# EAGLE design DAB+ FM Radio (EAGLE 7.6.0)
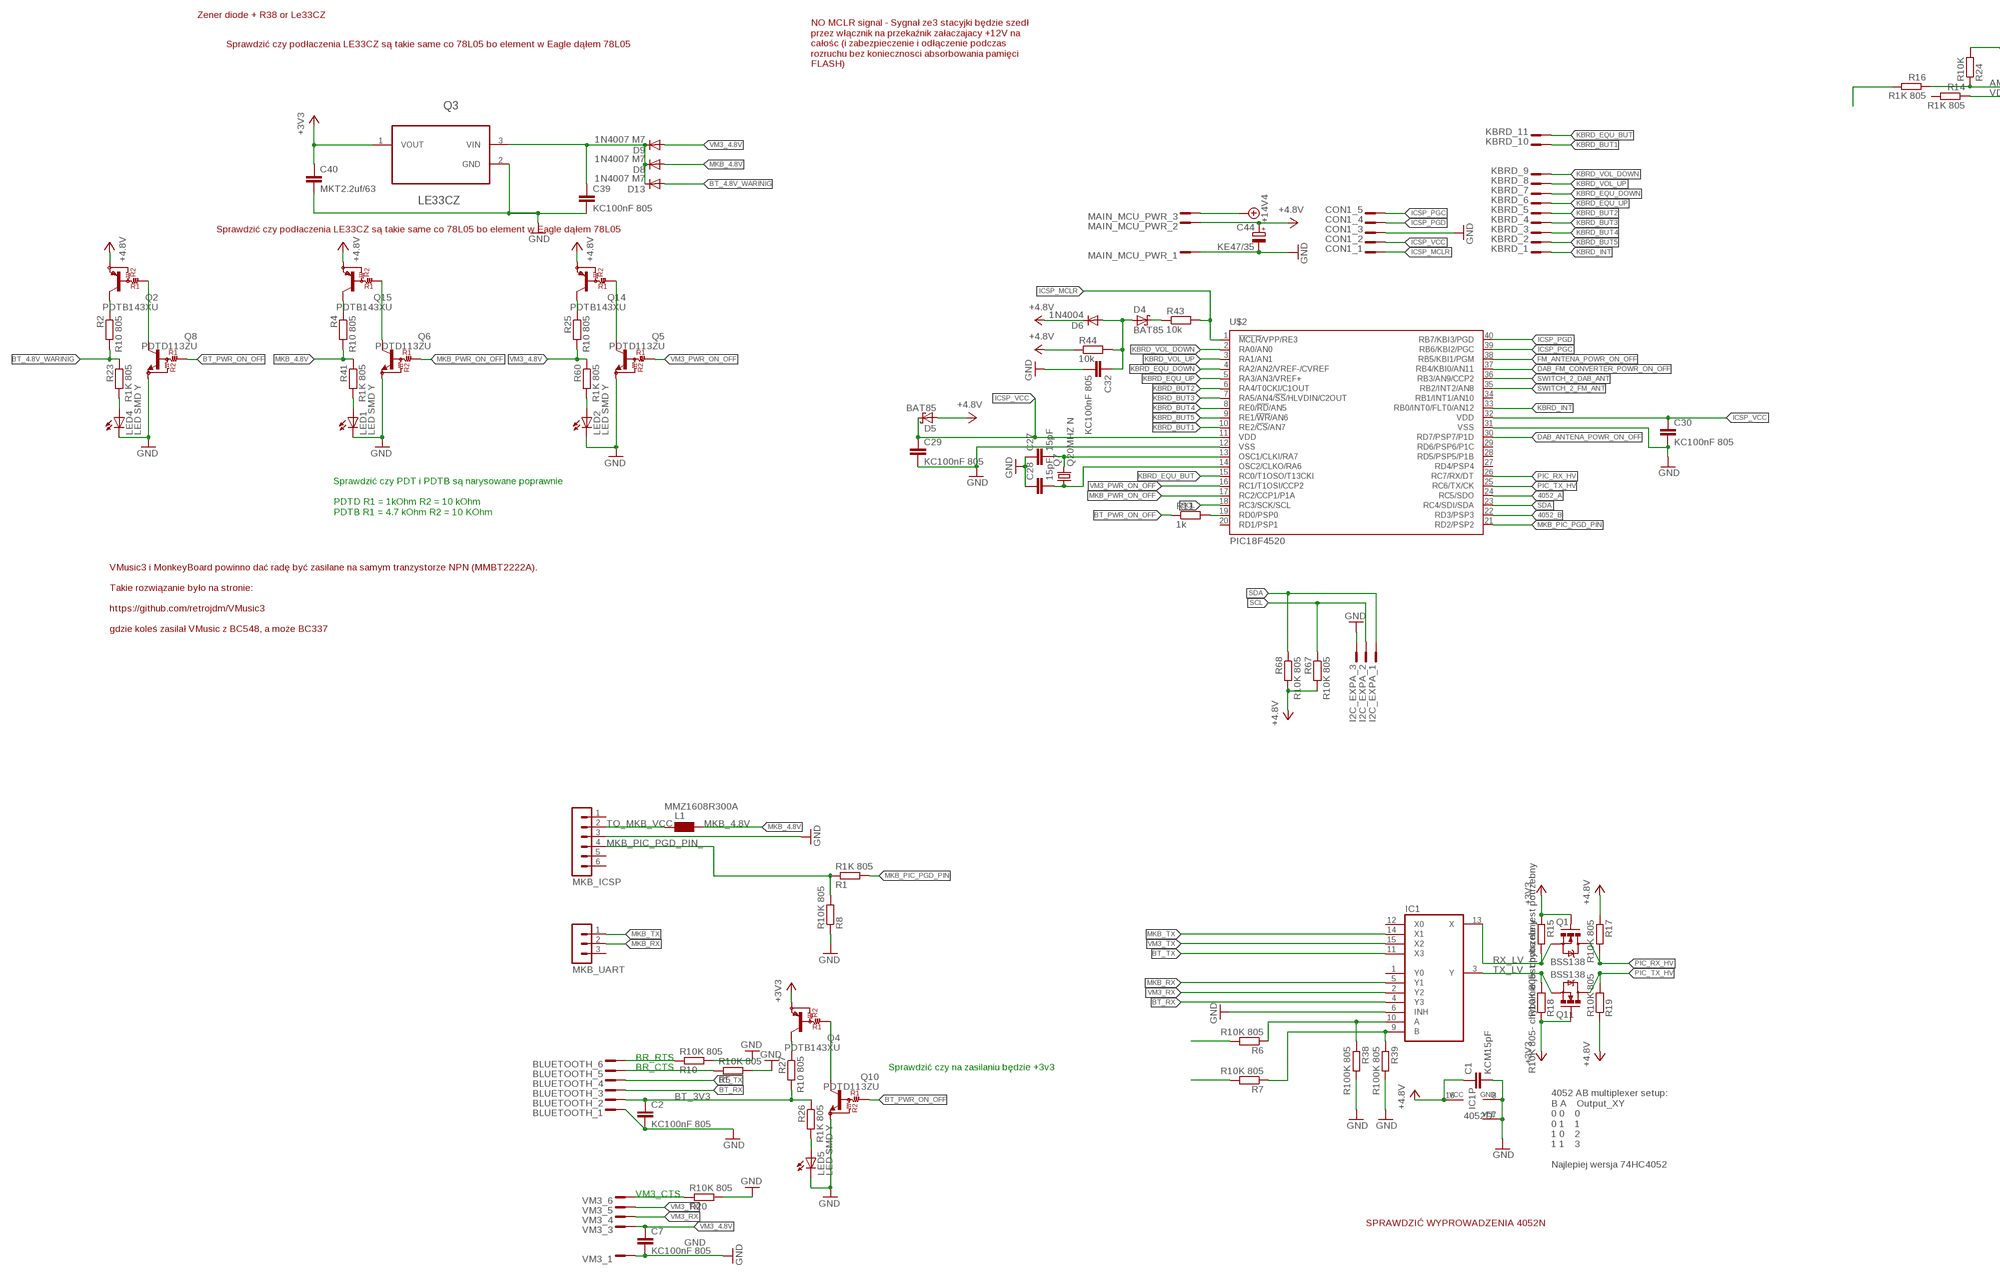
[diagram p0: schematic, sheet 1, part 1 of 2]
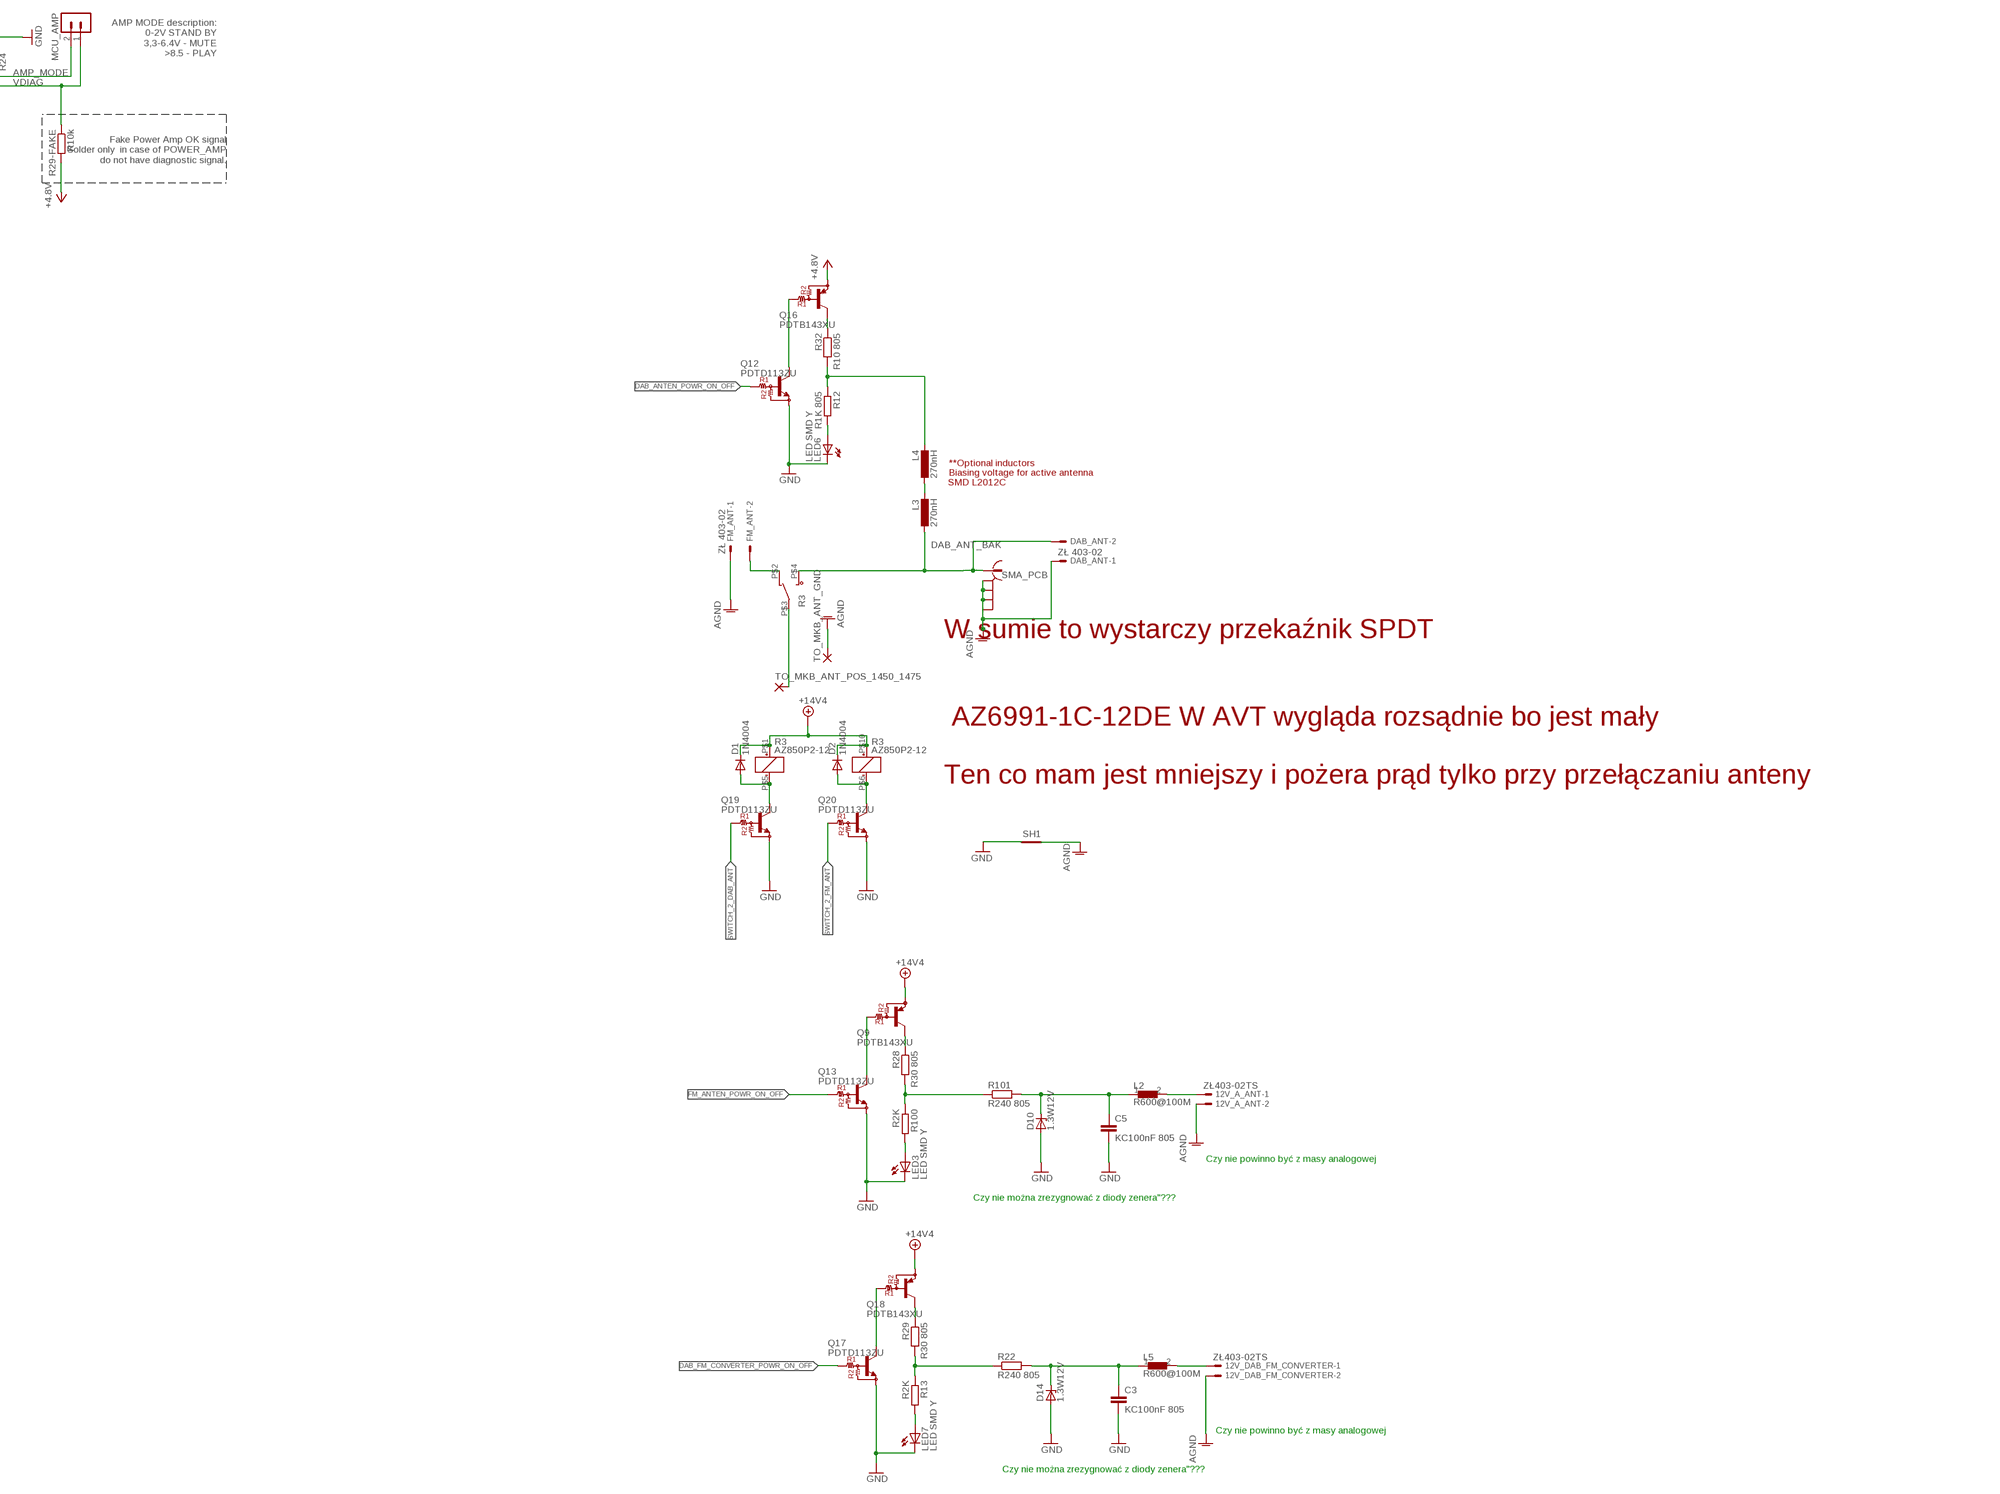
[diagram p1: schematic, sheet 1, part 2 of 2]

## Parts
12V_A_ANT  ZŁ403-02TS  22-23-2021  [22-23-2021]
12V_DAB_FM_CONVERTER  ZŁ403-02TS  22-23-2021  [22-23-2021]
BLUETOOTH  JST_6_PIN_B6B-PH-KS  [B6B-PH-KS]
C1  KCM15pF  C-EUC0805  [C0805]
C2  KC100nF 805  C-EUC0805  [C0805]
C3  KC100nF 805  C-EUC0805  [C0805]
C5  KC100nF 805  C-EUC0805  [C0805]
C7  KC100nF 805  C-EUC0805  [C0805]
C27  15pF  C-EUC0805  [C0805]
C28  15pF  C-EUC0805  [C0805]
C29  KC100nF 805  C-EUC0805  [C0805]
C30  KC100nF 805  C-EUC0805  [C0805]
C32  KC100nF 805  C-EUC0805  [C0805]
C39  KC100nF 805  C-EUC0805  [C0805]
C40  MKT2.2uf/63  C-EU025-030X050  [C025-030X050]
C44  KE47/35  CPOL-EUTT2D6  [TT2D6]
CON1  JST_5_PIN_B5B-PH-KS  [B5B-PH-KS]
D1  1N4004  1N4004DO41-7.6  [DO41-7.6]
D2  1N4004  1N4004DO41-7.6  [DO41-7.6]
D4  BAT85  BAT85DO34-V  [DO34-V]
D5  BAT85  BAT85DO34-5  [DO34-5]
D6  1N4004  1N4004DO41-V  [DO41-V]
D8  1N4007 M7  1N4004DO41-V  [DO41-V]
D9  1N4007 M7  1N4004DO41-V  [DO41-V]
D10  1.3W12V  ZENER-DIODEZD-2.5  [ZDIO-2.5]
D13  1N4007 M7  1N4004DO41-V  [DO41-V]
D14  1.3W12V  ZENER-DIODEZD-2.5  [ZDIO-2.5]
DAB_ANT  ZŁ 403-02  22-27-2021-02  [6410-02]
DAB_ANT_BAK  SMA_PCB  [SMA_PCB]
FM_ANT  ZŁ 403-02  22-27-2021-02  [6410-02]
I2C_EXPA  JST_3_PIN_B3B-PH-KS  [B3B-PH-KS]
IC1  4052D  [SO16]
KBRD  JST_11_PIN_B11B-PH-KS  [B11B-PH-KS]
L1  MMZ1608R300A  WE-CBF_0603  [0603]
L2  R600@100M  FERRITR0805  [R0805]
L3  270nH  L-EUL2012C  [L2012C]
L4  270nH  L-EUL2012C  [L2012C]
L5  R600@100M  FERRITR0805  [R0805]
LED1  LED SMD Y  LEDCHIP-LED0805  [CHIP-LED0805]
LED2  LED SMD Y  LEDCHIP-LED0805  [CHIP-LED0805]
LED3  LED SMD Y  LED  [SMARTLED-TTW]
LED4  LED SMD Y  LEDCHIP-LED0805  [CHIP-LED0805]
LED5  LED SMD Y  LEDCHIP-LED0805  [CHIP-LED0805]
LED6  LED SMD Y  LED  [SMARTLED-TTW]
LED7  LED SMD Y  LED  [SMARTLED-TTW]
MAIN_MCU_PWR  JST_3_PIN_B3B-XH-A  [B3B-XH-A]
MCU_AMP  MA02-1  [MA02-1]
MKB_ICSP  MA06-1  [MA06-1]
MKB_UART  MA03-1  [MA03-1]
Q1  BSS138  MOSFET-NCHANNELSMD  [SOT23-3]
Q2  PDTB143XU  [SOT-23]
Q3  LE33CZ  [TO127P254X749-3]
Q4  PDTB143XU  [SOT-23]
Q5  PDTD113ZU  [SOT-23]
Q6  PDTD113ZU  [SOT-23]
Q7  Q20MHZ N  CRYSTALHC49S  [HC49/S]
Q8  PDTD113ZU  [SOT-23]
Q9  PDTB143XU  [SOT-23]
Q10  PDTD113ZU  [SOT-23]
Q11  BSS138  MOSFET-NCHANNELSMD  [SOT23-3]
Q12  PDTD113ZU  [SOT-23]
Q13  PDTD113ZU  [SOT-23]
Q14  PDTB143XU  [SOT-23]
Q15  PDTB143XU  [SOT-23]
Q16  PDTB143XU  [SOT-23]
Q17  PDTD113ZU  [SOT-23]
Q18  PDTB143XU  [SOT-23]
Q19  PDTD113ZU  [SOT-23]
Q20  PDTD113ZU  [SOT-23]
R1  R1K 805  R-EU_R0805  [R0805]
R2  R10 805  R-EU_R0805  [R0805]
R3  AZ850P2-12  [AZ850-2C]
R4  R10 805  R-EU_R0805  [R0805]
R5  R10K 805  R-EU_R0805  [R0805]
R6  R10K 805  R-EU_R0805  [R0805]
R7  R10K 805  R-EU_R0805  [R0805]
R8  R10K 805  R-EU_R0805  [R0805]
R10  R10K 805  R-EU_R0805  [R0805]
R11  1k  R-EU_R0805  [R0805]
R12  R1K 805  R-EU_R0805  [R0805]
R13  R2K  R-EU_R0805  [R0805]
R14  R1K 805  R-EU_R0805  [R0805]
R15  R10K 805- chyba nie jest potrzebny  R-EU_R0805  [R0805]
R16  R1K 805  R-EU_R0805  [R0805]
R17  R10K 805  R-EU_R0805  [R0805]
R18  R10K 805- chyba nie jest potrzebny  R-EU_R0805  [R0805]
R19  R10K 805  R-EU_R0805  [R0805]
R20  R10K 805  R-EU_R0805  [R0805]
R22  R240 805  R-EU_M0805  [M0805]
R23  R1K 805  R-EU_R0805  [R0805]
R24  R10K  R-EU_R0805  [R0805]
R25  R10 805  R-EU_R0805  [R0805]
R26  R1K 805  R-EU_R0805  [R0805]
R27  R10 805  R-EU_R0805  [R0805]
R28  R30 805  R-EU_R0805  [R0805]
R29  R30 805  R-EU_R0805  [R0805]
R29-FAKE  R10k  R-EU_0204/7  [0204/7]
R32  R10 805  R-EU_R0805  [R0805]
R38  R100K 805  R-EU_M0805  [M0805]
R39  R100K 805  R-EU_M0805  [M0805]
R41  R1K 805  R-EU_R0805  [R0805]
R43  10k  R-EU_R0805  [R0805]
R44  10k  R-EU_M0805  [M0805]
R60  R1K 805  R-EU_R0805  [R0805]
R67  R10K 805  R-EU_R0805  [R0805]
R68  R10K 805  R-EU_R0805  [R0805]
R100  R2K  R-EU_R0805  [R0805]
R101  R240 805  R-EU_M0805  [M0805]
SH1  SHORT-HT5  [SHORT_TOP-50]
TO_MKB_ANT_GND  2,54/0,8  [2,54/0,8]
TO_MKB_ANT_POS_1450_1475  2,54/0,8  [2,54/0,8]
U$2  PIC18F4520  [DIL40]
VM3  JST_6_PIN_B6B-PH-KS  [B6B-PH-KS]

## Nets
4052_A: R6.2 U$2.24(RC5/SDO)
4052_B: R7.2 U$2.22(RD3/PSP3)
+3V3: C40.1 Q1.1(G) Q3.1(VOUT) Q4.2(E) Q11.1(G) R15.1 R18.1
+5V: C1.1 C44.+ D5.A D6.C IC1.16(VCC) MAIN_MCU_PWR.P$2 Q2.2(E) Q14.2(E) Q15.2(E) Q16.2(E) R17.1 R19.1 R29-FAKE.2 R44.1 R67.2 R68.2 ; supply symbol labelled +4.8V
+14V4: D1.C D2.C MAIN_MCU_PWR.P$3 Q9.2(E) Q18.2(E) R3.P$1(S$1:+) R3.P$10(R$2:+)
AGND: 12V_A_ANT.2 12V_DAB_FM_CONVERTER.2 DAB_ANT.1 DAB_ANT_BAK.GND@1(GND) DAB_ANT_BAK.GND@2(GND) DAB_ANT_BAK.GND@3(GND) DAB_ANT_BAK.GND@4(GND) FM_ANT.1 SH1.2 TO_MKB_ANT_GND.1(P)
AMP_MODE: MCU_AMP.2 R16.1 R24.1
BT_3V3: BLUETOOTH.P$2 C2.1 R26.1 R27.2
BT_4.8V_WARINIG: D13.A R2.2 R23.1
BT_PWR_ON_OFF: Q8.1(B) Q10.1(B) R11.1
BT_RX: BLUETOOTH.P$3 IC1.4(Y3)
BT_TX: BLUETOOTH.P$4 IC1.11(X3)
DAB_ANTEN_POWR_ON_OFF: Q12.1(B)
DAB_ANTENA_POWR_ON_OFF: U$2.30(RD7/PSP7/P1D)
DAB_FM_CONVERTER_POWR_ON_OFF: Q17.1(B) U$2.37(RB4/KBI0/AN11)
FM_ANTEN_POWR_ON_OFF: Q13.1(B)
FM_ANTENA_POWR_ON_OFF: U$2.38(RB5/KBI1/PGM)
GND: BLUETOOTH.P$1 C1.2 C2.2 C3.2 C5.2 C7.2 C27.1 C28.1 C29.2 C30.2 C32.2 C39.2 C40.2 C44.- CON1.P$3 D10.A D14.A I2C_EXPA.P$3 IC1.6(INH) IC1.7(VEE) IC1.8(GND) LED1.C LED2.C LED3.C@1(C) LED4.C LED5.C LED6.C@1(C) LED7.C@1(C) MAIN_MCU_PWR.P$1 MKB_ICSP.3 Q3.2(GND) Q5.2(E) Q6.2(E) Q8.2(E) Q10.2(E) Q12.2(E) Q13.2(E) Q17.2(E) Q19.2(E) Q20.2(E) R5.2 R8.1 R10.2 R20.2 R24.2 R38.2 R39.2 SH1.1 U$2.12(VSS) U$2.31(VSS) VM3.P$1
ICSP_MCLR: CON1.P$1 R43.2 U$2.1(!MCLR!/VPP/RE3)
ICSP_PGC: CON1.P$5 U$2.39(RB6/KBI2/PGC)
ICSP_PGD: CON1.P$4 U$2.40(RB7/KBI3/PGD)
ICSP_VCC: C29.1 C30.1 CON1.P$2 D5.C U$2.11(VDD) U$2.32(VDD)
KBRD_BUT1: KBRD.P$10 U$2.10(RE2/!CS!/AN7)
KBRD_BUT2: KBRD.P$5 U$2.6(RA4/T0CKI/C1OUT)
KBRD_BUT3: KBRD.P$4 U$2.7(RA5/AN4/!SS!/HLVDIN/C2OUT)
KBRD_BUT4: KBRD.P$3 U$2.8(RE0/!RD!/AN5)
KBRD_BUT5: KBRD.P$2 U$2.9(RE1/!WR!/AN6)
KBRD_EQU_BUT: KBRD.P$11 U$2.15(RC0/T1OSO/T13CKI)
KBRD_EQU_DOWN: KBRD.P$7 U$2.4(RA2/AN2/VREF-/CVREF)
KBRD_EQU_UP: KBRD.P$6 U$2.5(RA3/AN3/VREF+)
KBRD_INT: KBRD.P$1 U$2.33(RB0/INT0/FLT0/AN12)
KBRD_VOL_DOWN: KBRD.P$9 U$2.2(RA0/AN0)
KBRD_VOL_UP: KBRD.P$8 U$2.3(RA1/AN1)
MKB_4.8V: D8.A L1.2 R4.2 R41.1
MKB_PIC_PGD_PIN: R1.2 U$2.21(RD2/PSP2)
MKB_PIC_PGD_PIN_: MKB_ICSP.4 R1.1 R8.2
MKB_PWR_ON_OFF: Q6.1(B) U$2.17(RC2/CCP1/P1A)
MKB_RX: IC1.5(Y1) MKB_UART.2
MKB_TX: IC1.14(X1) MKB_UART.1
N$1: L4.1 R12.1 R32.2
N$2: D1.A Q19.3(C) R3.P$5(S$1:-)
N$3: R3.P$3 TO_MKB_ANT_POS_1450_1475.1(P)
N$4: DAB_ANT.2 DAB_ANT_BAK.P$1 L3.2 R3.P$4
N$5: FM_ANT.2 R3.P$2
N$6: D2.A Q20.3(C) R3.P$6(R$2:-)
N$7: Q2.3(C) R2.1
N$8: R16.2
N$12: L3.1 L4.2
N$13: IC1.9(B) R7.1 R39.1
N$15: C27.2 Q7.2 U$2.13(OSC1/CLKI/RA7)
N$16: C28.2 Q7.1 U$2.14(OSC2/CLKO/RA6)
N$17: R11.2 U$2.19(RD0/PSP0)
N$18: Q15.3(C) R4.1
N$19: Q2.1(B) Q8.3(C)
N$20: Q12.3(C) Q16.1(B)
N$21: LED4.A R23.2
N$22: Q4.1(B) Q10.3(C)
N$23: LED6.A@1(A) R12.2
N$24: LED5.A R26.2
N$25: Q17.3(C) Q18.1(B)
N$26: R13.1 R22.1 R29.2
N$27: LED7.A@1(A) R13.2
N$28: Q5.3(C) Q14.1(B)
N$29: C3.1 D14.C L5.1 R22.2
N$30: 12V_DAB_FM_CONVERTER.1 L5.2
N$31: LED2.A R60.2
N$32: Q14.3(C) R25.1
N$33: Q16.3(C) R32.1
N$34: Q9.3(C) R28.1
N$35: Q18.3(C) R29.1
N$36: Q4.3(C) R27.1
N$37: Q6.3(C) Q15.1(B)
N$38: BLUETOOTH.P$5 R5.1
N$39: LED1.A R41.2
N$41: D4.C R43.1
N$42: C32.1 D4.A D6.A R44.2
N$43: BLUETOOTH.P$6 R10.1
N$44: R20.1 VM3.P$6
N$47: IC1.10(A) R6.1 R38.1
N$68: C39.1 D8.C D9.C D13.C Q3.3(VIN)
N$85: Q9.1(B) Q13.3(C)
N$87: R28.2 R100.1 R101.1
N$88: LED3.A@1(A) R100.2
N$91: C5.1 D10.C L2.1 R101.2
N$92: 12V_A_ANT.1 L2.2
PIC_RX_HV: Q1.3(D) R17.2 U$2.26(RC7/RX/DT)
PIC_TX_HV: Q11.3(D) R19.2 U$2.25(RC6/TX/CK)
RX_LV: IC1.13(X) Q1.2(S) R15.2
SCL: I2C_EXPA.P$2 R67.1 U$2.18(RC3/SCK/SCL)
SDA: I2C_EXPA.P$1 R68.1 U$2.23(RC4/SDI/SDA)
SWITCH_2_DAB_ANT: Q19.1(B) U$2.36(RB3/AN9/CCP2)
SWITCH_2_FM_ANT: Q20.1(B) U$2.35(RB2/INT2/AN8)
TO_MKB_VCC: L1.1 MKB_ICSP.2
TX_LV: IC1.3(Y) Q11.2(S) R18.2
VDIAG: MCU_AMP.1 R14.1 R29-FAKE.1
VM3_4.8V: C7.1 D9.A R25.2 R60.1 VM3.P$3
VM3_PWR_ON_OFF: Q5.1(B) U$2.16(RC1/T1OSI/CCP2)
VM3_RX: IC1.2(Y2) VM3.P$4
VM3_TX: IC1.15(X2) VM3.P$5
Unconnected: IC1.1(Y0) IC1.12(X0) MKB_ICSP.1 MKB_ICSP.5 MKB_ICSP.6 MKB_UART.3 R3.P$7 R3.P$8 R3.P$9 R14.2 U$2.20(RD1/PSP1) U$2.27(RD4/PSP4) U$2.28(RD5/PSP5/P1B) U$2.29(RD6/PSP6/P1C) U$2.34(RB1/INT1/AN10) VM3.P$2

## Notes on the sheet
- Zener diode + R38 or Le33CZ
- Sprawdzić czy podłaczenia LE33CZ są takie same co 78L05 bo element w Eagle dąłem 78L05
- NO MCLR signal - Sygnał ze3 stacyjki będzie szedł
  przez włącznik na przekaźnik załaczajacy +12V na
  całośc (i zabezpieczenie i odłączenie podczas
  rozruchu bez koniecznosci absorbowania pamięci
  FLASH)
- AMP MODE description:
  0-2V STAND BY
  3,3-6.4V - MUTE
  >8.5 - PLAY
- Fake Power Amp OK signal
  Solder only  in case of POWER_AMP
  do not have diagnostic signal.
- Sprawdzić czy podłaczenia LE33CZ są takie same co 78L05 bo element w Eagle dąłem 78L05
- **Optional inductors
- Biasing voltage for active antenna
- SMD L2012C
- Sprawdzić czy PDT i PDTB są narysowane poprawnie
  
  PDTD R1 = 1kOhm R2 = 10 kOhm
  PDTB R1 = 4.7 kOhm R2 = 10 KOhm
- VMusic3 i MonkeyBoard powinno dać radę być zasilane na samym tranzystorze NPN (MMBT2222A).
  
  Takie rozwiązanie było na stronie:
  
  https://github.com/retrojdm/VMusic3
  
  gdzie koleś zasilał VMusic z BC548, a może BC337
- W sumie to wystarczy przekaźnik SPDT
  
  
   AZ6991-1C-12DE W AVT wygląda rozsądnie bo jest mały
  
  Ten co mam jest mniejszy i pożera prąd tylko przy przełączaniu anteny
- BR_RTS
- BR_CTS | Sprawdzić czy na zasilaniu będzie +3v3
- 4052 AB multiplexer setup:
  B A    Output_XY
  0 0    0
  0 1    1
  1 0    2
  1 1    3
  
  Najlepiej wersja 74HC4052
- Czy nie powinno być z masy analogowej
- VM3_CTS
- Czy nie można zrezygnować z diody zenera"???
- SPRAWDZIĆ WYPROWADZENIA 4052N
- Czy nie powinno być z masy analogowej
- Czy nie można zrezygnować z diody zenera"???

## Library data of the parts
12V_A_ANT 12V_DAB_FM_CONVERTER = con-molex:22-23-2021: .100" (2.54mm) Center Header - 2 Pin; MF: MOLEX; MPN: 22-23-2021; OC_FARNELL: 1462926; OC_NEWARK: 25C3832
BLUETOOTH VM3 = conn-JST:JST_6_PIN_
C1-C3 C5 C7 C27-C30 C32 C39 C40 = rcl:C-EU: CAPACITOR, European symbol
C44 = rcl:CPOL-EU: POLARIZED CAPACITOR, European symbol
CON1 = conn-JST:JST_5_PIN_
D1 D2 D6 D8 D9 D13 = diode_SileliS:1N4004: DIODE general purpose rectifier, 1 A
D4 D5 = diode_SileliS:BAT85
D10 D14 = diode:ZENER-DIODE: Z-Diode
DAB_ANT FM_ANT = con-molex:22-?-02: CONNECTOR wire to board 2.54 mm (.1 inch) pitch header; OC_FARNELL: unknown; OC_NEWARK: unknown
DAB_ANT_BAK = Monkey:SMA_PCB: TE CONNECTIVITY - 5-1814832-1 - SOCKET, SMA, STRAIGHT PCB,50OHM Manufacturer: TE CONNECTIVITY Order Code: 1248990 Manufacturer Part No: 5-1814832-1 http://www.farnell.com/datasheets/316178.pdf
I2C_EXPA MAIN_MCU_PWR = conn-JST:JST_3_PIN_
IC1 = 40xx:4052: Dual 4-channel ANALOG MULTIPLEXER
KBRD = conn-JST:JST_11_PIN_
L1 = wuerth-elektronik:WE-CBF: SMD EMI Suppression Ferrite Beads - excellent anti-EMI properties - low DCR - impedances till 3000 ohms - rated current up to 6 A
L2 L5 = ferrit_bear:FERRIT
L3 L4 = resistor:L-EU: INDUCTOR, European symbol
LED1-LED7 = adafruit:LED: LED OSRAM: - CHIPLED LG R971, LG N971, LY N971, LG Q971, LY Q971, LO R971, LY R971 LH N974, LH R974 LS Q976, LO Q976, LY Q976 LO Q996 - Hyper CHIPLED LW Q18S LB Q993, LB Q99A, LB R99A - SideLED LS A670, LO A670, LY A670, LG A670, LP A670 LB A673, LV A673, LT A673, LW A673 LH A674 LY A675 LS A676, LA A676, LO A676, LY A676, LW A676 LS A679, LY A679, LG A679 - Hyper Micro SIDELED® LS Y876, LA Y876, LO Y876, LY Y876 LT Y87S - SmartLED LW L88C, LW L88S LB L89C, LB L89S, LG L890 LS L89K, LO L89K, LY L89K LS L896, LA L896, LO L896, LY L896 - TOPLED LS T670, LO T670, LY T670, LG T670, LP T670 LSG T670, LSP T670, LSY T670, LOP T670, LYG T670 LG T671, LOG T671, LSG T671 LB T673, LV T673, LT T673, LW T673 LH T674 LS T676, LA T676, LO T676, LY T676, LB T676, LH T676, LSB T676, LW T676 LB T67C, LV T67C, LT T67C, LS T67K, LO T67K, LY T67K, LW E67C LS E67B, LA E67B, LO E67B, LY E67B, LB E67C, LV E67C, LT E67C LW T67C LS T679, LY T679, LG T679 LS T770, LO T770, LY T770, LG T770, LP T770 LB T773, LV T773, LT T773, LW T773 LH T774 LS E675, LA E675, LY E675, LS T675 LS T776, LA T776, LO T776, LY T776, LB T776 LHGB T686 LT T68C, LB T68C - Hyper Mini TOPLED® LB M676 - Mini TOPLED Santana® LG M470 LS M47K, LO M47K, LY M47K Source: http://www.osram.convergy.de/
MCU_AMP = con-lstb_SileliS:MA02-1: PIN HEADER
MKB_ICSP = con-lstb:MA06-1: PIN HEADER; OC_FARNELL: unknown; OC_NEWARK: unknown
MKB_UART = con-lstb:MA03-1: PIN HEADER; OC_FARNELL: unknown; OC_NEWARK: unknown
Q1 Q11 = SparkFun:MOSFET-NCHANNEL
Q2 Q4 Q9 Q14-Q16 Q18 = pre-bias-transistor:PDTB: PNP Resistor-Equipped Transistor (RET) family in a very small SOT323 (SC-70) Surface-Mounted Device (SMD) plastic package. VCC = -50 IC (max) = -500mA; R1: 4.7 kOhm; R2: 10 kOhm
Q3 = LE33cz:LE33CZ: VOLTAGE REGULATORS; MPN: LE33CZ; OC_FARNELL: 9755349; OC_NEWARK: 26M0166; PACKAGE: TO-92; SUPPLIER: STMICROELECTRONICS
Q5 Q6 Q8 Q10 Q12 Q13 Q17 Q19 Q20 = pre-bias-transistor:PDTD: Pre biase NPN transistor NPN Resistor-Equipped Transistor (RET) family in a very small SOT323 (SC-70) Surface-Mounted Device (SMD) plastic package. VCC = 50V Ic (max) = 500 mA; R1: 1 kOhm; R2: 10 kOhm
Q7 = adafruit:CRYSTAL: CRYSTAL; OC_FARNELL: 1667008; OC_NEWARK: unknown
R1 R2 R4-R8 R10-R20 R22-R29 R29-FAKE R32 R38 R39 R41 R43 R44 R60 R67 R68 R100 R101 = rcl:R-EU_: RESISTOR, European symbol
R3 = relay_silelis:AZ850P2-12
SH1 = shorts-old:SHORT-H: Short between two nets; BOM: no
TO_MKB_ANT_GND TO_MKB_ANT_POS_1450_1475 = wirepad:2,54/0,8: THROUGH-HOLE PAD
U$2 = microchip_SileliS:PIC18F4*20

## Board
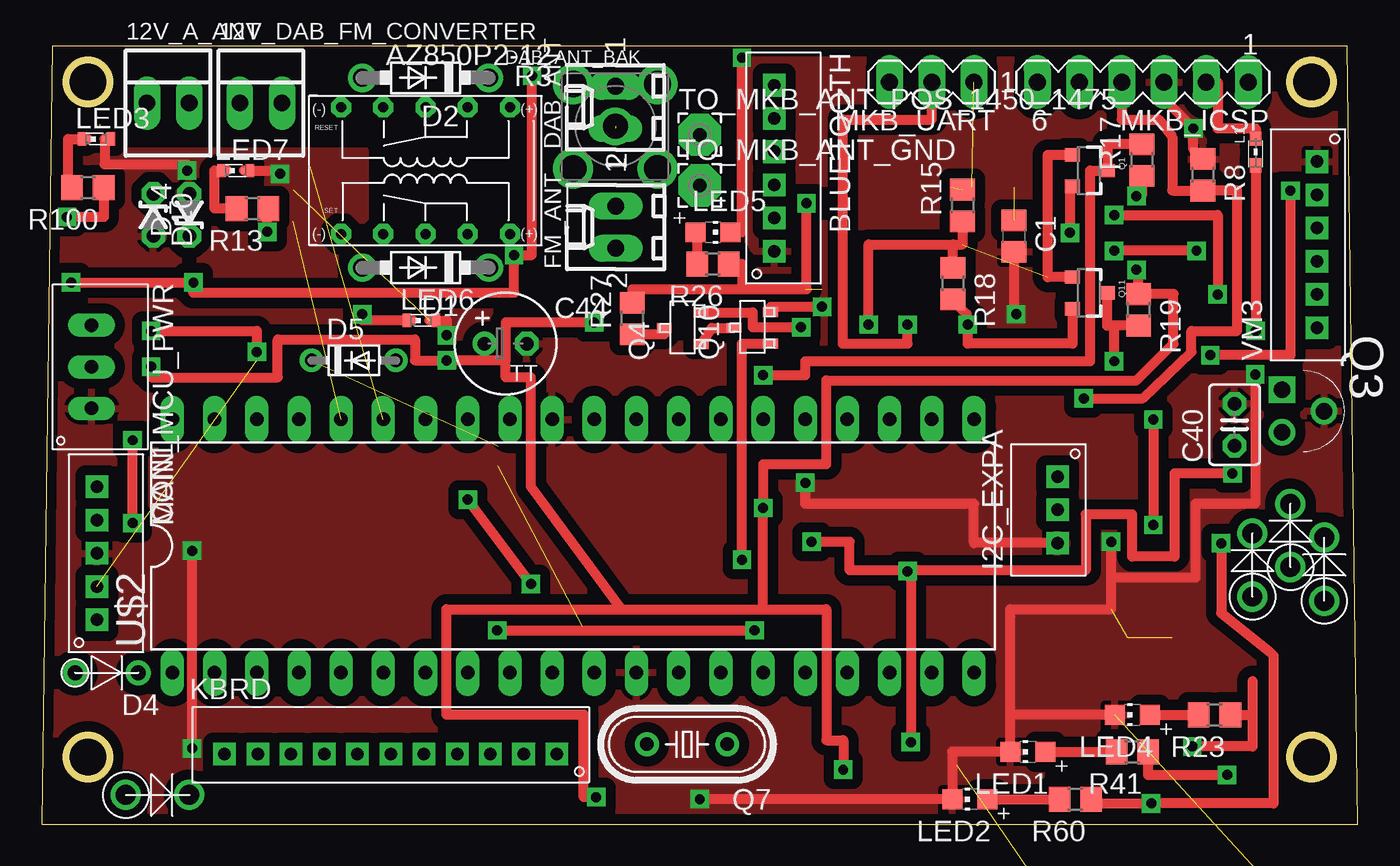
[diagram p2: board, top side]
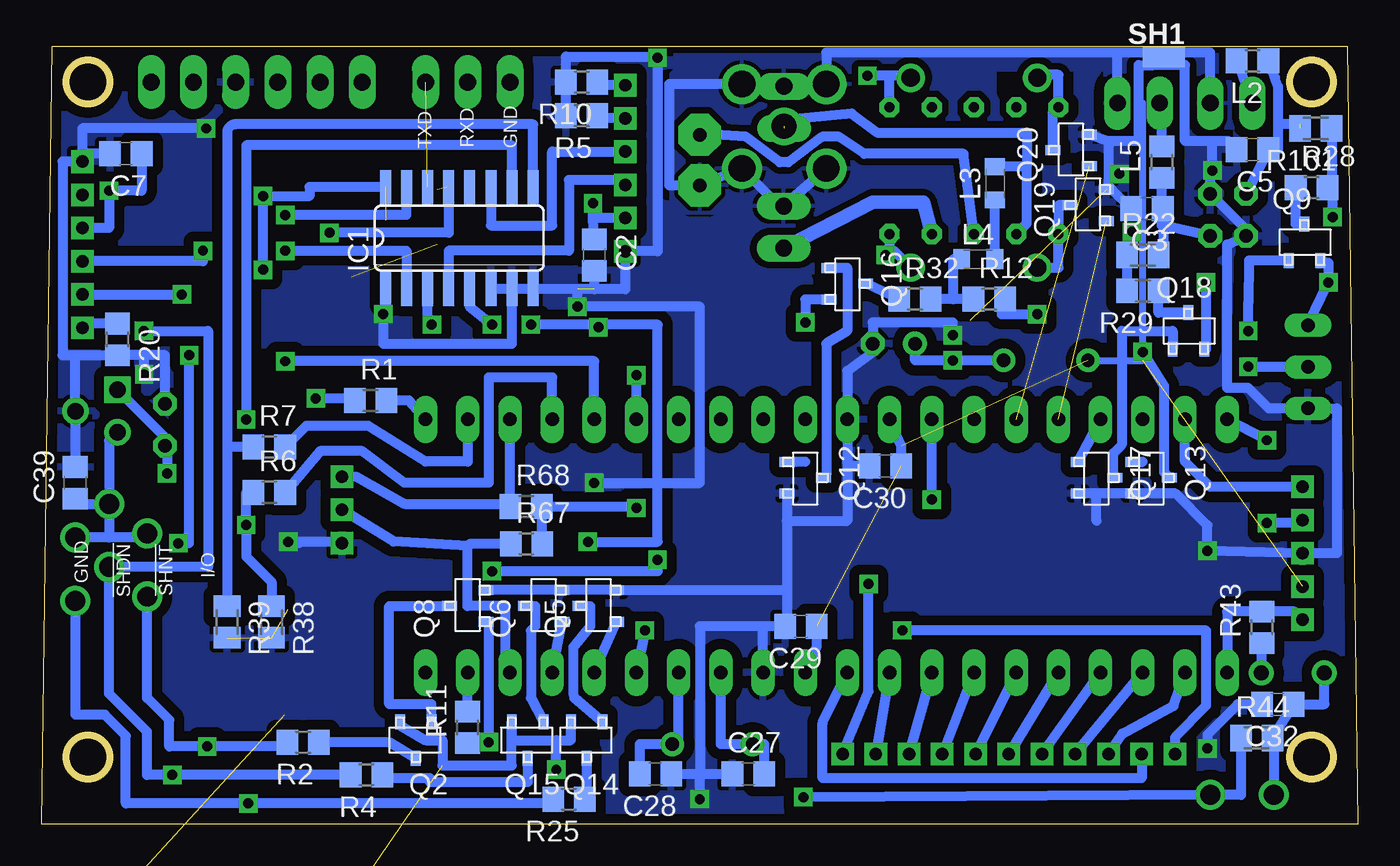
[diagram p3: board, bottom side, seen from below]

Size 79.25 x 46.86 mm. Coordinates in mm from the lower left corner, seen from the top.
Outline: 0.64,46.86 0,0 79.25,0 78.61,46.86 0.64,46.86
Outline: circle at 2.79,44.7 radius 1.32
Outline: circle at 2.79,4.06 radius 1.32
Outline: circle at 76.45,4.06 radius 1.32
Outline: circle at 76.45,44.7 radius 1.32
Copper layers (1*16): Top 0.035mm / dielectric 1.5mm / Bottom 0.035mm
Design rules "SparkFun": minimum track width 8mil, minimum drill 20mil, track to track 8mil, track to pad 8mil, pad to pad 8mil, via to via 8mil, smd to smd 8mil, copper to edge 10mil, drill to drill 8mil, minimum pad ring 12mil, minimum via ring 10mil, stop-mask expansion 4mil, vias tented up to drill 25mil, thermal gap 10mil

### Footprints (pad centres in the part's own frame; a part is rotated, then mirrored left to right if it is on the bottom)
22-23-2021 = drill 1 long: 1 -1.27,0; 2 1.27,0
B6B-PH-KS = drill 0.75 pad 1.2 square: P$1 -2,1.7; P$2 -4,1.7; P$3 -6,1.7; P$4 -8,1.7; P$5 -10,1.7; P$6 -12,1.7
C0805 = smd 1.3 x 1.5: 1 -0.95,0; 2 0.95,0
C025-030X050 = drill 0.813 octagon: 1 -1.27,0; 2 1.27,0
TT2D6 = drill 0.813: + -1.27,0 | drill 0.813 octagon: - 1.27,0
B5B-PH-KS = drill 0.75 pad 1.2 square: P$1 -2,1.7; P$2 -4,1.7; P$3 -6,1.7; P$4 -8,1.7; P$5 -10,1.7
DO41-7.6 = drill 1.1 pad 1.7: A 3.81,0; C -3.81,0
DO34-V = drill 0.9: A 3.81,0; C 0,0
DO34-5 = drill 0.8: A 2.54,0; C -2.54,0
DO41-V = drill 1.2: A 2.54,0; C -1.27,0
ZDIO-2.5 = drill 0.813 octagon: A 1.27,0; C -1.27,0
6410-02 = drill 1.016 long: 1 1.27,0; 2 -1.27,0
SMA_PCB = drill 1.6: GND@1 -2.54,2.54; GND@2 2.54,2.54; GND@3 -2.54,-2.54; GND@4 2.54,-2.54 | drill 1.5: P$1 0,0
B3B-PH-KS = drill 0.75 pad 1.2 square: P$1 -2,1.7; P$2 -4,1.7; P$3 -6,1.7
SO16 = smd 0.66 x 2.032: 1 -4.445,-3.073; 2 -3.175,-3.073; 3 -1.905,-3.073; 4 -0.635,-3.073; 5 0.635,-3.073; 6 1.905,-3.073; 7 3.175,-3.073; 8 4.445,-3.073; 9 4.445,3.073; 10 3.175,3.073; 11 1.905,3.073; 12 0.635,3.073; 13 -0.635,3.073; 14 -1.905,3.073; 15 -3.175,3.073; 16 -4.445,3.073
B11B-PH-KS = drill 0.75 pad 1.2 square: P$1 -2,1.7; P$2 -4,1.7; P$3 -6,1.7; P$4 -8,1.7; P$5 -10,1.7; P$6 -12,1.7; P$7 -14,1.7; P$8 -16,1.7; P$9 -18,1.7; P$10 -20,1.7; P$11 -22,1.7
0603 = smd 0.85 x 0.7: 1 -0.9,0; 2 0.7,0
R0805 = smd 1.3 x 1.5: 1 -0.95,0; 2 0.95,0
L2012C = smd 1 x 1.2: 1 -1,0; 2 1,0
CHIP-LED0805 = smd 1.2 x 1.2: A 0,-1.05; C 0,1.05
SMARTLED-TTW = smd 0.8 x 0.5: A 0,-0.875; C 0,0.875 | smd 0.35 x 0.35: A@1 0,-0.5; C@1 0,0.5
B3B-XH-A = drill 0.8 long: P$1 -2.45,2.35; P$2 -4.95,2.35; P$3 -7.45,2.35
MA02-1 = drill 1.016 long: 1 -2.54,0; 2 0,0
MA06-1 = drill 1.016 long: 1 -6.35,0; 2 -3.81,0; 3 -1.27,0; 4 1.27,0; 5 3.81,0; 6 6.35,0
MA03-1 = drill 1.016 long: 1 -2.54,0; 2 0,0; 3 2.54,0
SOT23-3 = smd 0.8 x 0.9: 1 -0.95,-1; 2 0.95,-1; 3 0,1.1
SOT-23 = smd 0.6 x 0.9: 1 -1,-1.1; 2 0.9,-1.1; 3 -0.05,1.1
TO127P254X749-3 = drill 0.991 square: 1 -2.54,-2.54 | drill 0.991: 2 -1.27,0; 3 0,-2.54
HC49/S = drill 0.813: 1 -2.413,0; 2 2.413,0
AZ850-2C = drill 0.6 octagon: P$1 -5.08,3.81; P$2 -2.54,3.81; P$3 0,3.81; P$4 2.54,3.81; P$5 5.08,3.81; P$6 5.08,-3.81; P$7 2.54,-3.81; P$8 0,-3.81; P$9 -2.54,-3.81; P$10 -5.08,-3.81
M0805 = smd 1.3 x 1.6: 1 -0.95,0; 2 0.95,0
0204/7 = drill 0.813 octagon: 1 -3.81,0; 2 3.81,0
SHORT_TOP-50 = smd 1.27 x 1.27: 1 0.635,0; 2 -0.635,0
2,54/0,8 = drill 0.813 pad 2.54 octagon: 1 0,0
DIL40 = drill 0.813 long: 1 -24.13,-7.62; 2 -21.59,-7.62; 3 -19.05,-7.62; 4 -16.51,-7.62; 5 -13.97,-7.62; 6 -11.43,-7.62; 7 -8.89,-7.62; 8 -6.35,-7.62; 9 -3.81,-7.62; 10 -1.27,-7.62; 11 1.27,-7.62; 12 3.81,-7.62; 13 6.35,-7.62; 14 8.89,-7.62; 15 11.43,-7.62; 16 13.97,-7.62; 17 16.51,-7.62; 18 19.05,-7.62; 19 21.59,-7.62; 20 24.13,-7.62; 21 24.13,7.62; 22 21.59,7.62; 23 19.05,7.62; 24 16.51,7.62; 25 13.97,7.62; 26 11.43,7.62; 27 8.89,7.62; 28 6.35,7.62; 29 3.81,7.62; 30 1.27,7.62; 31 -1.27,7.62; 32 -3.81,7.62; 33 -6.35,7.62; 34 -8.89,7.62; 35 -11.43,7.62; 36 -13.97,7.62; 37 -16.51,7.62; 38 -19.05,7.62; 39 -21.59,7.62; 40 -24.13,7.62

### Placement (x,y rotation side)
12V_A_ANT  7.62,43.43 0 top
12V_DAB_FM_CONVERTER  13.21,43.43 0 top
BLUETOOTH  42.42,32.51 270 top
C1  58.53,35.43 270 top
C2  45.97,34.29 270 bottom
C3  12.7,37.08 180 bottom
C5  6.35,40.64 180 bottom
C7  74.17,40.39 180 bottom
C27  36.7,3.05 0 bottom
C28  42.29,3.05 180 bottom
C29  33.53,11.94 180 bottom
C30  28.45,21.59 180 bottom
C32  4.83,7.24 180 bottom
C39  77.22,20.57 90 bottom
C40  71.82,24.07 90 top
C44  27.94,28.96 0 top
CON1  1.63,10.32 270 top
D1  23.11,33.53 180 top
D2  23.11,44.96 180 top
D4  5.83,9.13 180 top
D5  18.8,27.94 0 top
D6  7.62,1.78 180 top
D8  75.18,18.03 270 top
D9  77.22,16 270 top
D10  6.73,36.7 270 top
D13  72.9,16.26 270 top
D14  8.89,36.7 90 top
DAB_ANT  34.54,43.18 90 top
DAB_ANT_BAK  34.54,42.04 90 top
FM_ANT  34.57,35.97 90 top
I2C_EXPA  62.86,22.94 90 top
IC1  54.1,35.31 0 bottom
KBRD  33.02,2.54 0 top
L1  73.09,40.39 270 top
L2  6.35,45.97 180 bottom
L3  21.84,38.61 90 bottom
L4  22.86,34.04 0 bottom
L5  11.81,39.88 90 bottom
LED1  59.37,4.38 90 top
LED2  55.88,1.52 90 top
LED3  3.3,41.27 270 top
LED4  65.66,6.6 90 top
LED5  40.43,35.65 270 top
LED6  22.86,30.35 270 top
LED7  11.68,39.37 270 top
MAIN_MCU_PWR  0.66,22.61 270 top
MCU_AMP  65.02,-75.95 0 top  (outside the outline)
MKB_ICSP  66.29,44.7 180 top
MKB_UART  53.59,44.7 180 top
Q1  63.06,39.37 270 top
Q2  56.77,5.08 180 bottom
Q3  77.22,23.62 270 top
Q4  38.59,29.93 90 top
Q5  45.72,13.21 90 bottom
Q6  49.02,13.21 90 bottom
Q7  38.86,4.83 180 top
Q8  53.59,13.21 90 bottom
Q9  3.17,35.05 0 bottom
Q10  42.79,29.95 90 top
Q11  63.06,32 270 top
Q12  33.27,20.83 270 bottom
Q13  12.45,20.83 270 bottom
Q14  46.48,5.08 180 bottom
Q15  50.04,5.08 180 bottom
Q16  30.73,32.51 270 bottom
Q17  15.75,20.83 270 bottom
Q18  10.16,29.72 0 bottom
Q19  16.26,37.34 90 bottom
Q20  17.27,40.64 90 bottom
R1  59.44,25.53 0 bottom
R2  63.5,4.95 180 bottom
R3  23.11,39.37 180 top
R4  59.69,2.98 180 bottom
R5  46.74,42.67 180 bottom
R6  65.53,20 0 bottom
R7  65.53,22.73 0 bottom
R8  69.91,39.12 270 top
R10  46.74,44.7 180 bottom
R11  53.59,5.84 90 bottom
R12  22.2,31.62 0 bottom
R13  12.7,37.08 180 top
R14  48.51,-44.2 0 top  (outside the outline)
R15  55.45,37.27 90 top
R16  58.67,-44.2 0 top  (outside the outline)
R17  66.23,40.01 90 top
R18  54.86,32.58 270 top
R19  66.04,30.99 270 top
R20  74.68,29.21 270 bottom
R22  12.95,34.29 0 bottom
R23  70.61,6.6 180 top
R24  115.82,-50.55 0 top  (outside the outline)
R25  47.5,1.52 180 bottom
R26  40.42,33.74 180 top
R27  35.56,30.47 90 top
R28  2.79,38.35 0 bottom
R29  12.95,32.13 180 bottom
R29-FAKE  114.55,-88.65 0 top  (outside the outline)
R32  26.67,31.62 0 bottom
R38  65.41,12.19 270 bottom
R39  68.07,12.19 270 bottom
R41  65.66,4.38 180 top
R43  5.79,11.88 90 bottom
R44  6.1,5.21 0 bottom
R60  62.23,1.52 180 top
R67  50.05,16.88 0 bottom
R68  50.07,19.15 0 bottom
R100  2.79,38.35 180 top
R101  2.54,41.91 180 bottom
SH1  11.68,46.23 180 bottom
TO_MKB_ANT_GND  39.62,38.48 0 top
TO_MKB_ANT_POS_1450_1475  39.62,41.53 0 top
U$2  32,16.76 0 top
VM3  78.49,41.91 90 top

### Tracks (layer width: path | path; a pad name or v marks a point on that pad's centre or on a via)
4052_A
  Bottom 0.61: U$2.24 48.51,26.92 52.32,26.92 52.32,20.57 57.4,20.57 59.94,22.48 62.48,22.48 R6.2
4052_B
  Bottom 0.61: U$2.22 53.59,21.84 56.13,21.84 59.56,24 63.31,24 R7.2
+3V3  (via drill 0.6)  (1 unrouted)
  Top 0.61: 54.86,34.92 55.45,34.92 R15.1 | Q4.2 42.8,30.83 42.8,29.95 v45.72,29.95 | 54.86,34.92 49.78,34.92 v49.78,30.1 | R18.1 54.86,34.92 | v46.35,17.02 48.64,17.02 48.64,15.3 62.86,15.3 62.86,18.67 65.66,18.67 65.66,16.13 68.2,16.13 68.2,21.14 v71.69,21.14 | Q11.1 60.58,32.95 60.58,40.32 Q1.1
  Bottom 0.61: 45.27,30.1 v49.78,30.1 | v71.69,21.14 71.69,22.67 arc-90 C40.1 71.82,23.3 Q3.1 | v46.35,17.02 42.16,17.02 42.16,30.1 45.27,30.1 | 45.27,30.1 v45.72,29.95
+5V  (via drill 0.6)  (2 unrouted)
  Top 0.61: v33.27,30.23 27.94,30.23 27.94,27.94 | 27.94,27.94 v24.39,27.94 22.48,27.94 22.48,29.21 14.22,29.21 14.22,26.92 6.6,26.92 v6.6,27.56 | R17.1 66.23,37.85 v65.91,37.85 | v65.91,33.4 66.04,33.4 R19.1 68.13,31.94 68.13,28.96 65.91,26.73 47.24,26.73 47.24,21.69 43.43,21.69 v43.43,19.05 43.43,12.95 | 27.94,27.94 27.94,26.92 29.46,26.92 29.46,20.32 34.93,12.95 | 34.93,12.95 43.43,12.95 | v33.39,1.65 32.64,1.65 32.64,6.6 24.38,6.6 24.38,12.95 34.93,12.95 | 43.43,12.95 47.24,12.95 47.24,5.08 48.26,5.08 v48.26,3.3
  Bottom 0.61: Q2.2 57.67,5.98 56.13,5.08 55.12,5.08 55.12,3.56 50.94,3.56 Q15.2 50.94,5.08 48.26,5.08 | 48.26,5.08 47.38,5.08 Q14.2 | C44.+ 26.67,27.94 v24.39,27.94 D5.A | Q16.2 33.27,31.61 v33.27,30.23 | v33.39,1.65 D6.C 7.05,1.78 R44.1 | v48.26,3.3 48.26,5.08 | MAIN_MCU_PWR.P$2 5.97,27.56 v6.6,27.56 | IC1.16 63.12,38.38 63.12,37.85 v65.91,37.85 v65.91,33.4 | R67.2 49.12,16.88 R68.2 43.43,19.15 v43.43,19.05
+14V4  (via drill 0.6)
  Top 0.61: v1.78,32.64 v9.14,32.64 9.14,32 28.45,32 v28.45,34.29 29.53,34.29 v29.53,45.09
  Bottom 0.61: D1.C 27.94,34.54 28.19,34.54 | R3.P$1 28.19,34.54 | v28.45,34.29 28.19,34.54 | MAIN_MCU_PWR.P$3 v1.78,32.64 1.78,33.81 Q9.2 | Q18.2 9.14,28.62 v9.14,32.64 | D2.C 26.92,45.09 28.19,45.09 | 28.19,45.09 v29.53,45.09 | R3.P$10 28.19,45.09
AGND
  Bottom 0.406: DAB_ANT.1 37.08,44.7 DAB_ANT_BAK.GND@4
  Bottom 0.61: 12V_A_ANT.2 8.89,46.48 11.68,46.48 | 11.68,46.48 14.48,46.48 | 12V_DAB_FM_CONVERTER.2 14.48,46.48 | 14.48,46.48 32,46.48 DAB_ANT_BAK.GND@2 DAB_ANT_BAK.GND@4 41.47,44.58 41.47,38.48 TO_MKB_ANT_GND.1 DAB_ANT_BAK.GND@3 34.82,37.24 FM_ANT.1 DAB_ANT_BAK.GND@1 | SH1.2 11.68,46.23 11.68,46.48
  pour Bottom (isolate 0.406): 4.83,47.24 41.91,47.24 41.91,36.83 38.35,36.83 38.35,33.27 19.56,33.27 19.81,39.62 21.84,43.94 21.84,45.47 15.24,45.47 15.24,41.4 5.08,41.4 5.08,46.23 4.83,46.23
AMP_MODE  (2 unrouted)
BT_3V3  (via drill 0.6)
  Top 0.61: R26.1 42.16,33.74 42.16,32.23 | 42.16,32.23 46.05,32.23 v46.05,37.4 | R27.2 35.56,32.23 42.16,32.23
  Bottom 0.61: C2.1 46.05,36.51 | 46.05,36.51 v46.05,37.4 | BLUETOOTH.P$2 46.05,36.51
BT_4.8V_WARINIG  (via drill 0.6)
  Top 0.61: v69.28,4.7 72.9,4.7 72.9,6.6 | 72.9,8.64 72.9,6.6 | R23.1 72.9,6.6
  Bottom 0.61: D13.A 72.9,7.62 71.56,6.29 71.56,4.7 v69.28,4.7 64.45,4.7 R2.2
BT_PWR_ON_OFF  (via drill 0.6)
  Top 0.61: v52.32,4.95 52.32,15.05 v52.13,15.24 | v42.16,15.94 42.16,28.95 Q10.1
  Bottom 0.61: Q8.1 52.32,12.04 v52.32,4.95 v52.32,4.96 R11.1 | v42.16,15.94 42.16,15.24 v52.13,15.24
BT_RX
  Bottom 0.61: BLUETOOTH.P$3 44.12,38.8 47.5,38.8 47.5,34.54 54.74,34.54 IC1.4
BT_TX
  Bottom 0.61: IC1.11 52.2,36.07 48.51,36.07 48.51,40.51 BLUETOOTH.P$4
DAB_ANTEN_POWR_ON_OFF
  Bottom 0.61: 33.27,21.83 Q12.1
DAB_FM_CONVERTER_POWR_ON_OFF
  Bottom 0.61: U$2.37 Q17.1
FM_ANTEN_POWR_ON_OFF
  Bottom 0.61: Q13.1 12.95,21.83
GND  (via drill 0.6)  (5 unrouted)
  Top 0.61: LED6.C@1 24.39,30.35 v24.39,29.46 | v39.62,1.52 LED2.C 54.83,4.38 LED1.C 58.32,6.6 | v9.07,4.58 v9.07,16.48 | v73.07,27.1 73.07,19.3 69.47,19.3 69.47,14.86 64.39,14.86 | LED5.C 42.16,35.65 v42.16,46.17 | LED3.C@1 3.8,39.75 8.76,39.75 v8.76,39.37 | Q10.2 43.89,31.18 v46.99,31.18 | R8.1 69.34,40.64 v69.34,41.91 67.56,43.69 MKB_ICSP.3 | LED4.C 58.32,6.6 | LED7.C@1 14.35,39.37 v14.35,39.18 | 58.32,6.6 58.32,12.95 64.39,12.95 64.39,14.86 | 64.39,14.86 v64.39,17.02 | I2C_EXPA.P$3 56.13,16.94 56.13,19.3 45.97,19.3 v45.97,20.57 | C1.2 58.53,30.73 v58.67,30.73
  Bottom 0.61: Q8.2 Q6.2 Q5.2 34.49,14.11 arc-90 34.37,14.22 | 14.99,39.18 14.99,38.49 Q19.2 14.8,38.24 C3.2 | 14.99,39.18 14.99,40.89 15.01,41.08 | 15.01,41.08 15.02,41.15 Q20.2 | 12.32,45.72 10.41,45.72 10.41,41.15 8.76,41.15 | 15.01,41.08 15.01,41.15 13.21,41.15 13.21,45.72 12.32,45.72 | 12.32,45.72 SH1.1 | Q13.2 15.75,19.93 | 15.75,19.93 Q17.2 | C5.2 7.81,41.15 8.76,41.15 | 8.76,41.15 v8.76,39.37 8.89,39.5 D14.A 6.73,35.81 D10.A 7.87,34.92 7.87,26.29 6.6,26.29 5.37,25.06 MAIN_MCU_PWR.P$1 1.27,25.06 1.27,16.32 CON1.P$3 v9.07,16.48 9.07,18.02 10.98,19.93 Q13.2 | 13.55,19.9 Q13.2 | v24.39,29.46 24.39,30.23 29.21,30.23 C44.- 29.21,28.45 30.73,27.3 U$2.31 30.73,21.84 | 34.37,14.22 Q12.2 34.37,18.29 30.73,18.29 30.73,21.84 | 34.37,14.22 34.37,11.94 C29.2 35.81,11.94 | 15.75,18.29 15.75,19.93 | C30.2 30.48,21.59 arc90 30.73,21.84 | C28.1 39.62,3.05 | 39.62,3.05 C27.1 | 35.81,11.94 39.62,11.94 39.62,3.05 | R5.2 R10.2 47.69,46.23 42.22,46.23 arc90 v42.16,46.17 42.16,34.51 BLUETOOTH.P$1 44.11,32.23 46.99,32.23 | v69.34,41.91 76.79,41.91 VM3.P$1 | v39.62,1.52 39.62,3.05 | VM3.P$1 77.98,39.91 77.98,28.26 77.22,28.26 | 77.22,28.26 R20.2 73.07,28.26 | 77.22,28.26 Q3.2 C39.2 | C7.2 76.79,40.39 VM3.P$1 | IC1.7 IC1.8 46.99,32.23 | C2.2 45.97,32.23 | C32.2 7.24,7.24 9.07,5.41 v9.07,4.58 | IC1.7 IC1.6 | U$2.12 35.81,11.94 | 46.99,32.23 v46.99,31.18 39.62,31.18 39.62,20.57 v45.97,20.57 | IC1.7 50.93,28.96 58.67,28.96 v58.67,30.73 | v14.35,39.18 14.99,39.18 | C40.2 71.82,28.26 73.07,28.26 | v73.07,27.1 73.07,28.26 | 63.75,16.94 v64.39,17.02 61.16,17.02 I2C_EXPA.P$3
  pour Top (isolate 0.61): 0.25,-2.29 0.25,40.58 19.49,40.58 19.49,33.27 42.16,33.27 42.16,47.24 78.99,47.24 78.99,-2.29
  pour Bottom (isolate 0.61): 0.25,-6.1 0.25,48.51 78.99,48.51 78.99,-6.1
ICSP_MCLR
  Bottom 0.61: CON1.P$1 3.83,12.82 R43.2 7.87,12.82 U$2.1
ICSP_PGC
  Bottom 0.61: CON1.P$5 8.89,20.32 10.41,21.84 U$2.39
ICSP_PGD  (via drill 0.6)
  Top 0.61: v5.48,18.14 v5.48,23.14
  Bottom 0.61: CON1.P$4 3.51,18.14 v5.48,18.14 | v5.48,23.14 U$2.40
ICSP_VCC  (3 unrouted)
  Bottom 0.406: D5.C 12.95,27.94 12.95,43.43
  Bottom 0.61: C30.1 27.5,22.8 U$2.32 | U$2.11 32.58,10.73 C29.1
KBRD_BUT1
  Bottom 0.61: KBRD.P$10 13.02,2.79 18.03,2.79 18.03,2.78 32.23,2.78 32.23,6.11 U$2.10
KBRD_BUT2
  Bottom 0.61: U$2.6 KBRD.P$5
KBRD_BUT3
  Bottom 0.61: U$2.7 KBRD.P$4
KBRD_BUT4
  Bottom 0.61: U$2.8 KBRD.P$3
KBRD_BUT5
  Bottom 0.61: U$2.9 KBRD.P$2
KBRD_EQU_BUT  (via drill 0.6)
  Top 0.61: v27.43,11.68 v42.93,11.68
  Bottom 0.61: v27.43,11.68 9.14,11.68 9.14,7.16 11.02,5.24 KBRD.P$11 | v42.93,11.68 U$2.15
KBRD_EQU_DOWN
  Bottom 0.61: U$2.4 KBRD.P$7
KBRD_EQU_UP
  Bottom 0.61: U$2.5 KBRD.P$6
KBRD_INT  (via drill 0.6)
  Top 0.61: v29.46,14.48 v25.65,19.56
  Bottom 0.61: KBRD.P$1 29.46,8.02 v29.46,14.48 | v25.65,19.56 U$2.33
KBRD_VOL_DOWN
  Bottom 0.61: KBRD.P$9 14.19,5.47 11.11,7.14 U$2.2
KBRD_VOL_UP
  Bottom 0.61: KBRD.P$8 U$2.3
MKB_4.8V  (via drill 0.6)
  Top 0.61: L1.2 v73.09,29.72 | R41.1 66.61,2.99 v71.37,2.99
  Bottom 0.61: R4.2 v71.37,2.99 72.9,2.99 72.9,5.59 75.18,7.87 D8.A 69.23,15.49 69.23,29.72 v73.09,29.72
MKB_PIC_PGD_PIN
  Bottom 0.61: U$2.21 57.15,25.53 R1.2
MKB_PIC_PGD_PIN_  (via drill 0.6)
  Top 0.61: MKB_ICSP.4 65.02,42.45 67.25,42.45 68.07,41.4 68.07,38.17 R8.2 71.97,38.17 71.97,29.72 69.23,29.72 69.23,28.45 66.29,25.65 v62.74,25.65
  Bottom 0.61: R1.1 60.52,25.65 v62.74,25.65
MKB_PWR_ON_OFF
  Bottom 0.61: U$2.17 Q6.1
MKB_RX  (via drill 0.6)
  Top 0.61: MKB_UART.2 53.59,42.45 48.24,42.45 48.24,28.96 52.13,28.96 v52.13,30.1
  Bottom 0.61: IC1.5 53.47,31.18 v52.13,30.1
MKB_TX  (1 unrouted)
  Top 0.61: 56.01,44.7 MKB_UART.1
N$1
  Bottom 0.61: 23.81,34.04 L4.1 24.38,34.04 24.38,31.62 | R12.1 24.38,31.62 | 24.38,31.62 R32.2
N$2
  Bottom 0.61: D1.A 18.03,33.53 R3.P$5 18.03,37.29 Q19.3
N$3
  Bottom 0.61: R3.P$3 23.75,40.39 29.72,40.39 31.24,41.4 32.26,41.4 34.29,39.88 34.8,39.88 36.83,41.4 38.73,41.53 TO_MKB_ANT_POS_1450_1475.1
N$4  (1 unrouted)
  Bottom 0.61: DAB_ANT_BAK.P$1 34.54,42.42 30.48,42.8 28.96,41.66 19.94,41.66 19.94,39.62 | L3.2 21.84,39.62 19.94,39.62 | R3.P$4 19.94,36.2 19.94,39.62
N$5
  Bottom 0.813: FM_ANT.2 29.21,37.47 26.16,37.47 R3.P$2
N$6
  Bottom 0.61: 19.13,45.14 arc-90 D2.A 19.3,45.14 18.03,45.14 R3.P$6 18.37,42.84 Q20.3
N$7
  Bottom 0.61: Q2.3 58.33,4.95 R2.1
N$12
  Bottom 0.61: L4.2 21.86,37.61 L3.1
N$13
  Bottom 0.61: R7.1 68.07,22.73 | 68.07,22.73 R39.1 | IC1.9 49.66,42.16 67.56,42.16 arc-90 68.07,41.66 68.07,22.73
N$15
  Bottom 0.61: C27.2 35.75,4.83 Q7.2 38.35,4.83 U$2.13
N$16
  Bottom 0.61: C28.2 43.24,4.83 Q7.1 40.89,4.83 U$2.14
N$17
  Bottom 0.61: R11.2 U$2.19
N$18
  Bottom 0.61: Q15.3 49.99,2.54 55.88,2.54 55.88,2.79 58.74,2.79 R4.1
N$19
  Bottom 0.61: Q2.1 55.77,7.24 58.32,7.24 58.32,13.16 Q8.3
N$20
  Bottom 0.61: Q12.3 32,21.05 32,28.96 30.73,29.72 30.73,33.51 Q16.1
N$21
  Top 0.61: LED4.A R23.2
N$22
  Top 0.61: Q4.1 40.35,29.9 Q10.3
N$23  (via drill 0.6)
  Top 0.61: LED6.A@1 19.3,30.35 v19.3,30.73
  Bottom 0.61: R12.2 21.47,30.73 v19.3,30.73
N$24
  Top 0.61: LED5.A 39.47,35.65 R26.2
N$25
  Bottom 0.61: Q17.3 14.73,20.96 14.73,22.35 14.22,22.86 14.22,29.72 11.16,29.72 Q18.1
N$26  (via drill 0.6)
  Top 0.61: v13.59,35.69 13.59,37.02 arc-90 R13.1
  Bottom 0.61: R29.2 R22.1 arc-90 13.59,34.61 v13.59,35.69
N$27
  Top 0.61: R13.2 10.41,37.08 10.41,39.37 LED7.A@1
N$28
  Bottom 0.61: Q5.3 46.23,13.16 46.23,11.94 47.24,10.67 47.24,7.87 47.18,7.62 Q14.1
N$29
  Bottom 0.61: D14.C 11.68,36.07 | 11.68,36.07 11.81,36.07 L5.1 11.81,37.08 C3.1 | R22.2 11.68,35.05 11.68,36.07
N$30
  Bottom 0.61: L5.2 11.81,43.43 12V_DAB_FM_CONVERTER.1
N$31
  Top 0.61: LED2.A R60.2
N$32
  Bottom 0.61: 46.69,1.52 R25.1 46.43,1.52 Q14.3
N$33
  Bottom 0.61: R32.1 Q16.3
N$34
  Bottom 0.61: Q9.3 3.74,36.15 R28.1
N$35
  Bottom 0.61: Q18.3 12,30.82 R29.1
N$36
  Top 0.61: R27.1 37.49,29.52 Q4.3
N$37
  Bottom 0.61: Q6.3 49.53,13.16 49.53,11.94 49.78,11.68 49.78,7.62 Q15.1
N$38
  Bottom 0.61: BLUETOOTH.P$5 45.79,42.51 R5.1
N$39
  Top 0.61: LED1.A R41.2
N$41
  Bottom 0.61: D4.C 5.79,9.13 R43.1
N$42
  Bottom 0.61: D6.A 5.08,4.51 R44.2 C32.1 2.02,7.24 D4.A
N$43
  Bottom 0.61: BLUETOOTH.P$6 45.79,44.51 R10.1
N$44
  Bottom 0.61: R20.1 76.79,30.16 VM3.P$6
N$47  (via drill 0.6)
  Top 0.61: v66.93,24.38 v66.93,18.03
  Bottom 0.61: R38.1 65.41,14.61 66.93,16.13 v66.93,18.03 66.93,20 R6.1 | IC1.10 50.93,40.89 66.93,40.89 v66.93,24.38
N$68
  Bottom 0.61: D13.C 73.15,17.27 75.18,17.27 | 75.18,17.27 D9.C | D8.C 75.18,17.27 | Q3.3 75.18,23.11 D8.C | C39.1 76.9,19.3 D8.C
N$85  (via drill 0.6)
  Top 0.61: v6.6,29.72 12.95,29.72 v12.95,28.45
  Bottom 0.61: v12.95,28.45 11.68,26.42 11.68,21.22 Q13.3 | v6.6,29.72 6.6,31.37 6.56,33.95 Q9.1
N$87  (via drill 0.6)
  Top 0.61: R100.1 3.74,36.58 v1.52,36.58
  Bottom 0.61: v1.52,36.58 1.52,38.1 R28.2 1.59,38.35 R101.1
N$88
  Top 0.61: LED3.A@1 1.59,41.27 1.59,38.35 R100.2
N$91  (1 unrouted)
  Bottom 0.61: L2.1 arc5 4.83,44.45 4.83,42.16 | 4.83,42.16 4.83,40.64 C5.1 D10.C | 3.49,42.16 4.83,42.16
N$92
  Bottom 0.61: L2.2 12V_A_ANT.1
PIC_RX_HV  (via drill 0.6)
  Top 0.61: R17.2 64.16,40.95 Q1.3 63.12,39.37 63.12,27.89 45.97,27.89 45.97,27.05 v43.43,27.05
  Bottom 0.61: U$2.26 v43.43,27.05
PIC_TX_HV  (via drill 0.6)
  Top 0.61: R19.2 64.58,30.04 | 64.58,30.04 64.16,30.04 Q11.3 | v64.58,27.89 64.58,30.04
  Bottom 0.61: U$2.25 45.97,27.89 v64.58,27.89
RX_LV  (via drill 0.6)  (1 unrouted)
  Top 0.61: Q1.2 61.91,38.28 v61.91,35.62
  Bottom 0.61: IC1.13 54.74,35.62 v61.91,35.62
SCL
  Bottom 0.61: I2C_EXPA.P$2 58.05,17.04 53.61,16.76 | U$2.18 arc90 51.31,9.4 51.31,13.15 53.61,13.15 53.61,16.76 | R67.1 53.49,16.88 53.61,16.76
SDA
  Bottom 0.61: 51.05,19.3 51.05,19.18 R68.1 | 51.05,19.3 U$2.23 | I2C_EXPA.P$1 60.31,20.94 57.4,19.3 51.05,19.3
SWITCH_2_DAB_ANT  (1 unrouted)
SWITCH_2_FM_ANT  (1 unrouted)
TO_MKB_VCC
  Top 0.61: MKB_ICSP.2 70.8,44.7 70.8,41.91 73.09,41.91 L1.1
TX_LV  (via drill 0.6)
  Top 0.61: R18.2 54.86,31.56 55.69,30.73 55.69,30.16 v55.75,30.1 55.75,28.96 62.05,28.96 Q11.2
  Bottom 0.61: v55.75,30.1 56.01,29.84 IC1.3
VDIAG  (2 unrouted)
VM3_4.8V  (via drill 0.6)
  Top 0.61: R60.1 63.43,1.27 v66.8,1.27 74.17,1.27 74.17,10.16 73.91,10.41 71.02,12.74 v71.02,16.93 | v75.18,38.16 75.18,28.26 v70.36,28.26
  Bottom 0.61: R25.2 48.7,1.27 v66.8,1.27 74.17,1.27 74.17,5.33 75.44,6.6 77.22,6.6 D9.A | v70.36,28.26 70.38,28.26 70.38,16.93 v71.02,16.93 | VM3.P$3 75.18,35.91 v75.18,38.16 73.22,38.16 C7.1
VM3_PWR_ON_OFF
  Bottom 0.61: U$2.16 Q5.1
VM3_RX  (via drill 0.6)
  Top 0.61: v69.53,34.54 v64.58,34.54
  Bottom 0.61: v64.58,34.54 57.28,34.54 IC1.2 | v69.53,34.54 69.53,33.91 VM3.P$4
VM3_TX  (via drill 0.6)
  Top 0.61: v64.58,36.7 70.8,36.7 v70.8,31.91
  Bottom 0.61: VM3.P$5 v70.8,31.91 | IC1.15 57.28,36.7 v64.58,36.7

### Text on the board
bNames: GND | RXD | TXD | I/O | !SHNT! | !SHDN! | GND